# Altium schematic sheet Template.SchDoc
size A
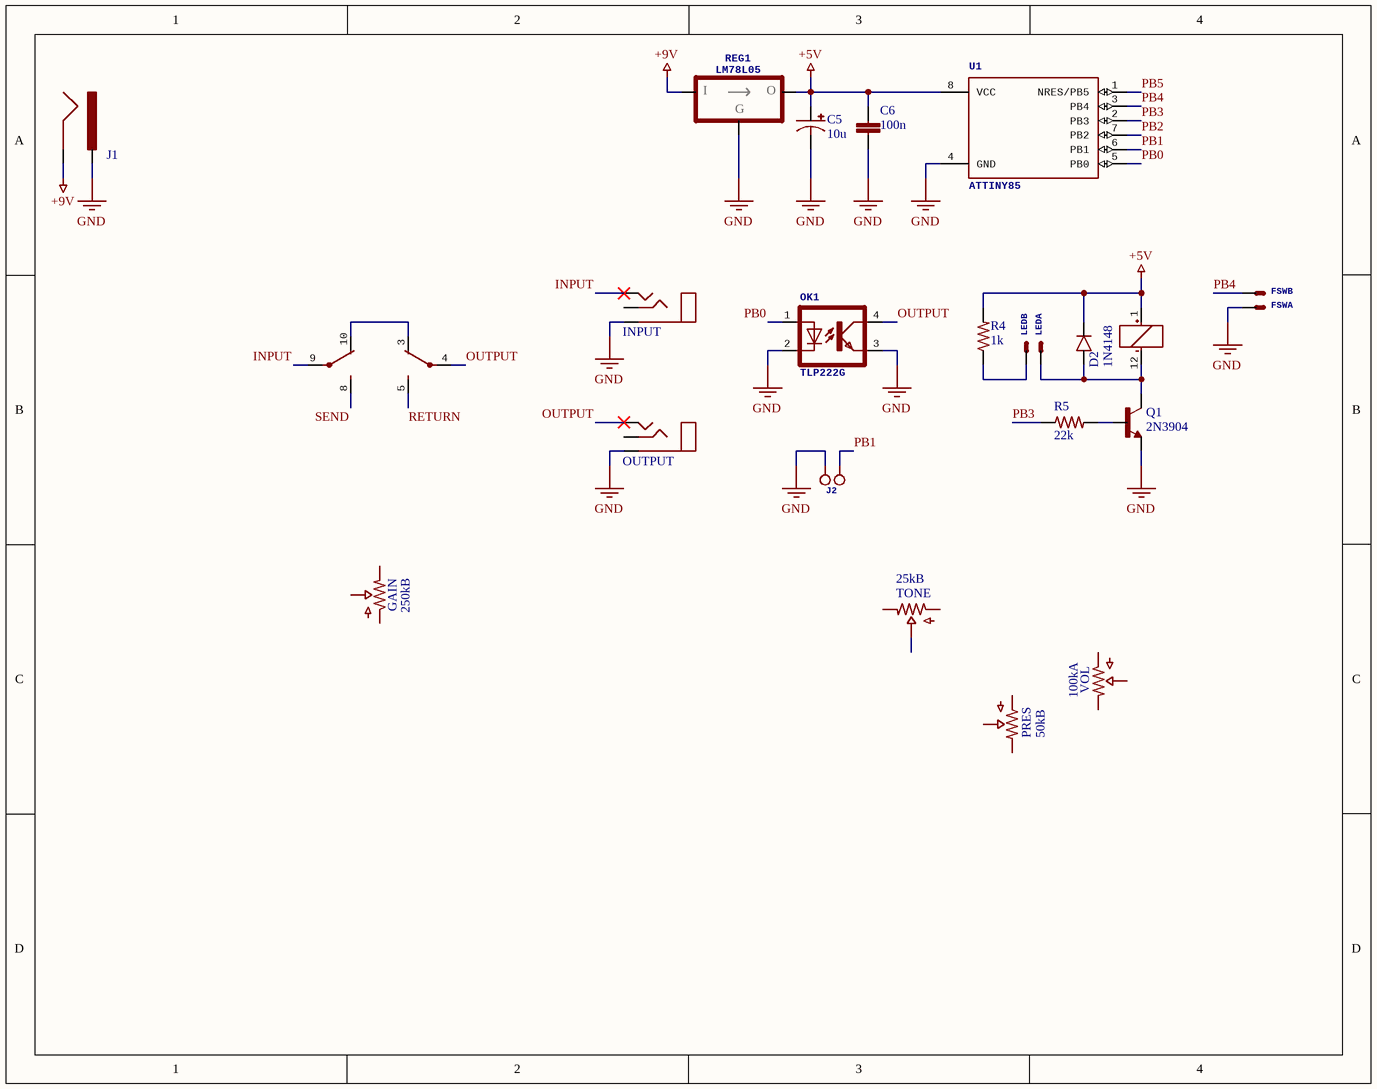
[diagram p0: Template.SchDoc]

## Parts
C5  10u  [ELEC_040_020]
C6  100n  [CER_050]
D2  1N4148  [DO35_2]
FSW  (no value)  [JST-XH-02]  (parts A,B of 2)
GAIN  250kB  [ALPHA_16mm_BOTTOM]
INPUT  (no value)  [STEREO]
J1  DC_JACK  [DC_JACK]  (value not drawn)
J2  HEADER_2PINS  [HEADER_2PINS]  (value not drawn)
K1  (no value)  [NA5]  (parts A,B,C of 3)
LED  (no value)  [JST-XH-02]  (parts A,B of 2)
OK1  TLP222G  [DIL4]
OUTPUT  (no value)  [STEREO]
PRES  50kB  [ALPHA_16mm_BOTTOM]
Q1  2N3904  [TO92]
R4  1k  [R_3_1k_025W]
R5  22k  [R_3_22k_025W]
REG1  LM78L05  [TO92]
TONE  25kB  [ALPHA_16mm_BOTTOM]
U1  ATTINY85  [DIP8]
VOL  100kA  [ALPHA_16mm_BOTTOM]

## Nets
+5V: C5.+ C6.2 D2.C K1.1(+) R4.2 REG1.3(VO) U1.8(VCC)
+9V: J1.GND REG1.1(VI)
GND: C5.- C6.1 FSW.2(S) INPUT.S J1.PWR J2.1 OK1.2(C) OK1.3(EMIT) OUTPUT.S Q1.3(E) REG1.2(GND) U1.4(GND)
INPUT: INPUT.T K1.9(P)
OUTPUT: K1.4(P) OK1.4(COL) OUTPUT.T
PB0: OK1.1(A) U1.5(PB0)
PB1: J2.2 U1.6(PB1)
PB2: U1.7(PB2)
PB3: R5.1 U1.2(PB3)
PB4: FSW.1(S) U1.3(PB4)
PB5: U1.1(NRES/PB5)
RETURN: K1.5(S)
SEND: K1.8(S)
NetD2_A: D2.A K1.12(-) LED.2(S) Q1.1(C)
NetK1_3: K1.3(O) K1.10(O)
NetLED_1: LED.1(S) R4.1
NetQ1_2: Q1.2(B) R5.2

Not connected (* = marked no-connect by the designer): GAIN 1 2 3; INPUT R; OUTPUT R; PRES 1 2 3; TONE 1 2 3; VOL 1 2 3

## Notes on the sheet
- (in symbol LM78L05) I; O; G

## Library data of the parts
C5 = ELEC_10u_50V
C6 = CER_100n
FSW LED = JST-XH-02
GAIN PRES TONE VOL = ALPHA_16mm
INPUT OUTPUT = STEREO
K1 = NA5W-K: OC_FARNELL: unknown; OC_NEWARK: unknown
R4 = R_3_1k_025W
R5 = R_3_22k_025W
OK1 = TLP222G: OC_FARNELL: unknown; OC_NEWARK: unknown